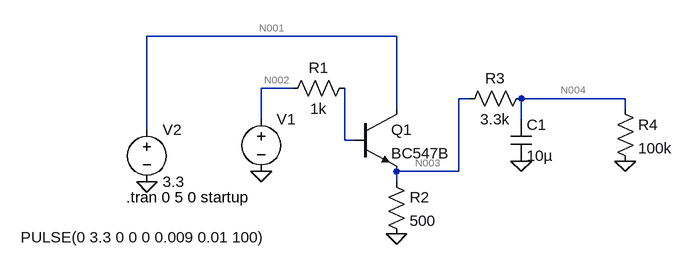
[diagram p0: schematic simRcyBJT.asc]
simRcyBJT.asc, the LTspice schematic file:
Version 4
SHEET 1 880 680
WIRE 304 0 -80 0
WIRE 144 80 96 80
WIRE 416 96 400 96
WIRE 656 96 496 96
WIRE 304 112 304 0
WIRE 656 112 656 96
WIRE 96 128 96 80
WIRE 496 128 496 96
WIRE -80 144 -80 0
WIRE 224 160 224 80
WIRE 240 160 224 160
WIRE 400 208 400 96
WIRE 400 208 304 208
WIRE 304 224 304 208
FLAG 96 208 0
FLAG -80 224 0
FLAG 496 192 0
FLAG 304 304 0
FLAG 656 192 0
SYMBOL voltage 96 112 R0
WINDOW 123 0 0 Left 0
WINDOW 39 0 0 Left 0
WINDOW 3 -370 197 Left 2
SYMATTR InstName V1
SYMATTR Value PULSE(0 3.3 0 0 0 0.009 0.01 100)
SYMBOL npn 240 112 R0
SYMATTR InstName Q1
SYMATTR Value BC547B
SYMBOL voltage -80 128 R0
WINDOW 123 0 0 Left 0
WINDOW 39 0 0 Left 0
SYMATTR InstName V2
SYMATTR Value 3.3
SYMBOL res 240 64 R90
WINDOW 0 0 56 VBottom 2
WINDOW 3 32 56 VTop 2
SYMATTR InstName R1
SYMATTR Value 1k
SYMBOL res 288 208 R0
SYMATTR InstName R2
SYMATTR Value 500
SYMBOL res 512 80 R90
WINDOW 0 0 56 VBottom 2
WINDOW 3 32 56 VTop 2
SYMATTR InstName R3
SYMATTR Value 3.3k
SYMBOL cap 480 128 R0
SYMATTR InstName C1
SYMATTR Value 10µ
SYMBOL res 640 96 R0
SYMATTR InstName R4
SYMATTR Value 100k
TEXT -112 248 Left 2 !.tran 0 5 0 startup

The netlist it stands for:
* simRcyBJT.asc
V1 N002 0 PULSE(0 3.3 0 0 0 0.009 0.01 100)
Q1 N001 N005 N003 0 BC547B
V2 N001 0 3.3
R1 N005 N002 1k
R2 N003 0 500
R3 N004 N003 3.3k
C1 N004 0 10µ
R4 N004 0 100k
.model NPN NPN
.model PNP PNP
.lib standard.bjt
.tran 0 5 0 startup
.backanno
.end

* Results of the author's LTspice run, read from the files saved beside the schematic
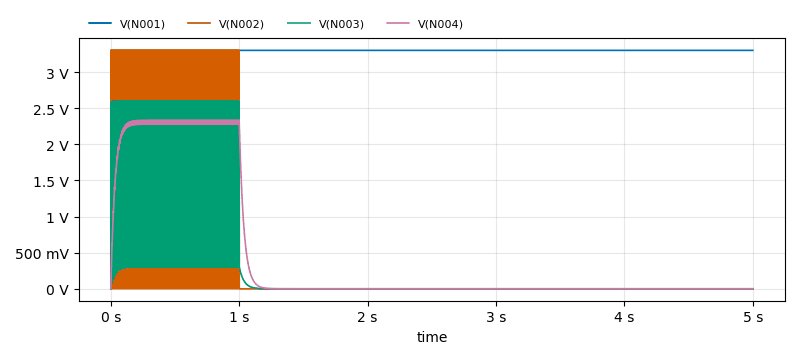
[diagram p1: Transient Analysis of simRcyBJT.asc, plotted from the saved traces]
* Transient Analysis, 1 run:
*   V(N001): min 0 V, max 3.3 V, average 3.3 V, rms 3.3 V, last 3.3 V
*   V(N002): min 0 V, max 3.3 V, average 600.6 mV, rms 1.405 V, last 0 V
*   V(N003): min 0 V, max 2.596 V, average 478.6 mV, rms 1.105 V, last 0 V
*   V(N004): min 0 V, max 2.335 V, average 463.3 mV, rms 1.016 V, last 0 V